# Altium schematic sheet 匿名光流V3.3版邮票孔接口原理图.SchDoc
size A4
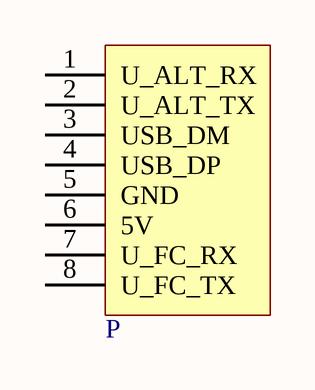
[diagram p0: 匿名光流V3.3版邮票孔接口原理图.SchDoc]

## Parts
P  ANO_OF  [ANO_OF]  (value not drawn)

## Nets

Not connected (* = marked no-connect by the designer): P 1(U_ALT_RX) 2(U_ALT_TX) 3(USB_DM) 4(USB_DP) 5(GND) 6(5V) 7(U_FC_RX) 8(U_FC_TX)